# Altium schematic sheet DC_Current_Sensing.SchDoc
size A; SheetNumber: 7; SheetTotal: 9
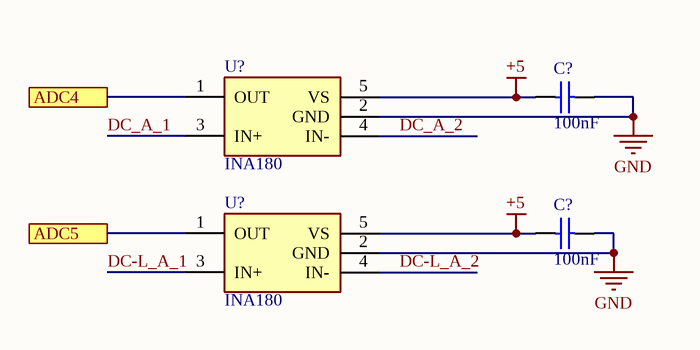
[diagram p0: DC_Current_Sensing.SchDoc]

## Parts
(Parts that share a designator on the sheet are numbered #1, #2 ... from top to bottom, then left to right.)
C?#1  value 100nF  [C0805]  (hidden comment: 10V)
C?#2  value 100nF  [C0805]  (hidden comment: 10V)
U?#1  INA180  [INA180]
U?#2  INA180  [INA180]

## Ports
ADC4, ADC5

## Nets
+5: C?#1.2 C?#2.2 U?#1.5(VS) U?#2.5(VS)
GND: C?#1.1 C?#2.1 U?#1.2(GND) U?#2.2(GND)
ADC4: U?#1.1(OUT) ; port ADC4
ADC5: U?#2.1(OUT) ; port ADC5
DC-L_A_1: U?#2.3(IN+)
DC-L_A_2: U?#2.4(IN-)
DC_A_1: U?#1.3(IN+)
DC_A_2: U?#1.4(IN-)

## Library data of the parts
C?#1 C?#2 = Cap: C0805C104K8RACTU. 0.1µF ±10% 10V Ceramic Capacitor X7R 0805 (2012 Metric) /; Published: 8-Jun-2000; LatestRevisionDate: 17-Jul-2002; LatestRevisionNote: Re-released for DXP Platform.; PackageReference: RAD-0.3; Publisher: Altium Limited; PackageDescription: Radial Cap, Thru-Hole; 2 Leads; 0.3 in Pin Spacing
U?#1 U?#2 = INA180: 0V to 26V Current Sense Amplifier; Manufacturer: Texas Instruments; Manufacturer Part Number: INA180A2IDBVR; Datasheet: https://www.ti.com/lit/ds/symlink/ina180.pdf; Supplier Part Number: 296-47653-1-ND; Supplier: Digikey